# Altium schematic sheet relays_1-4_DS4E.SchDoc
size B
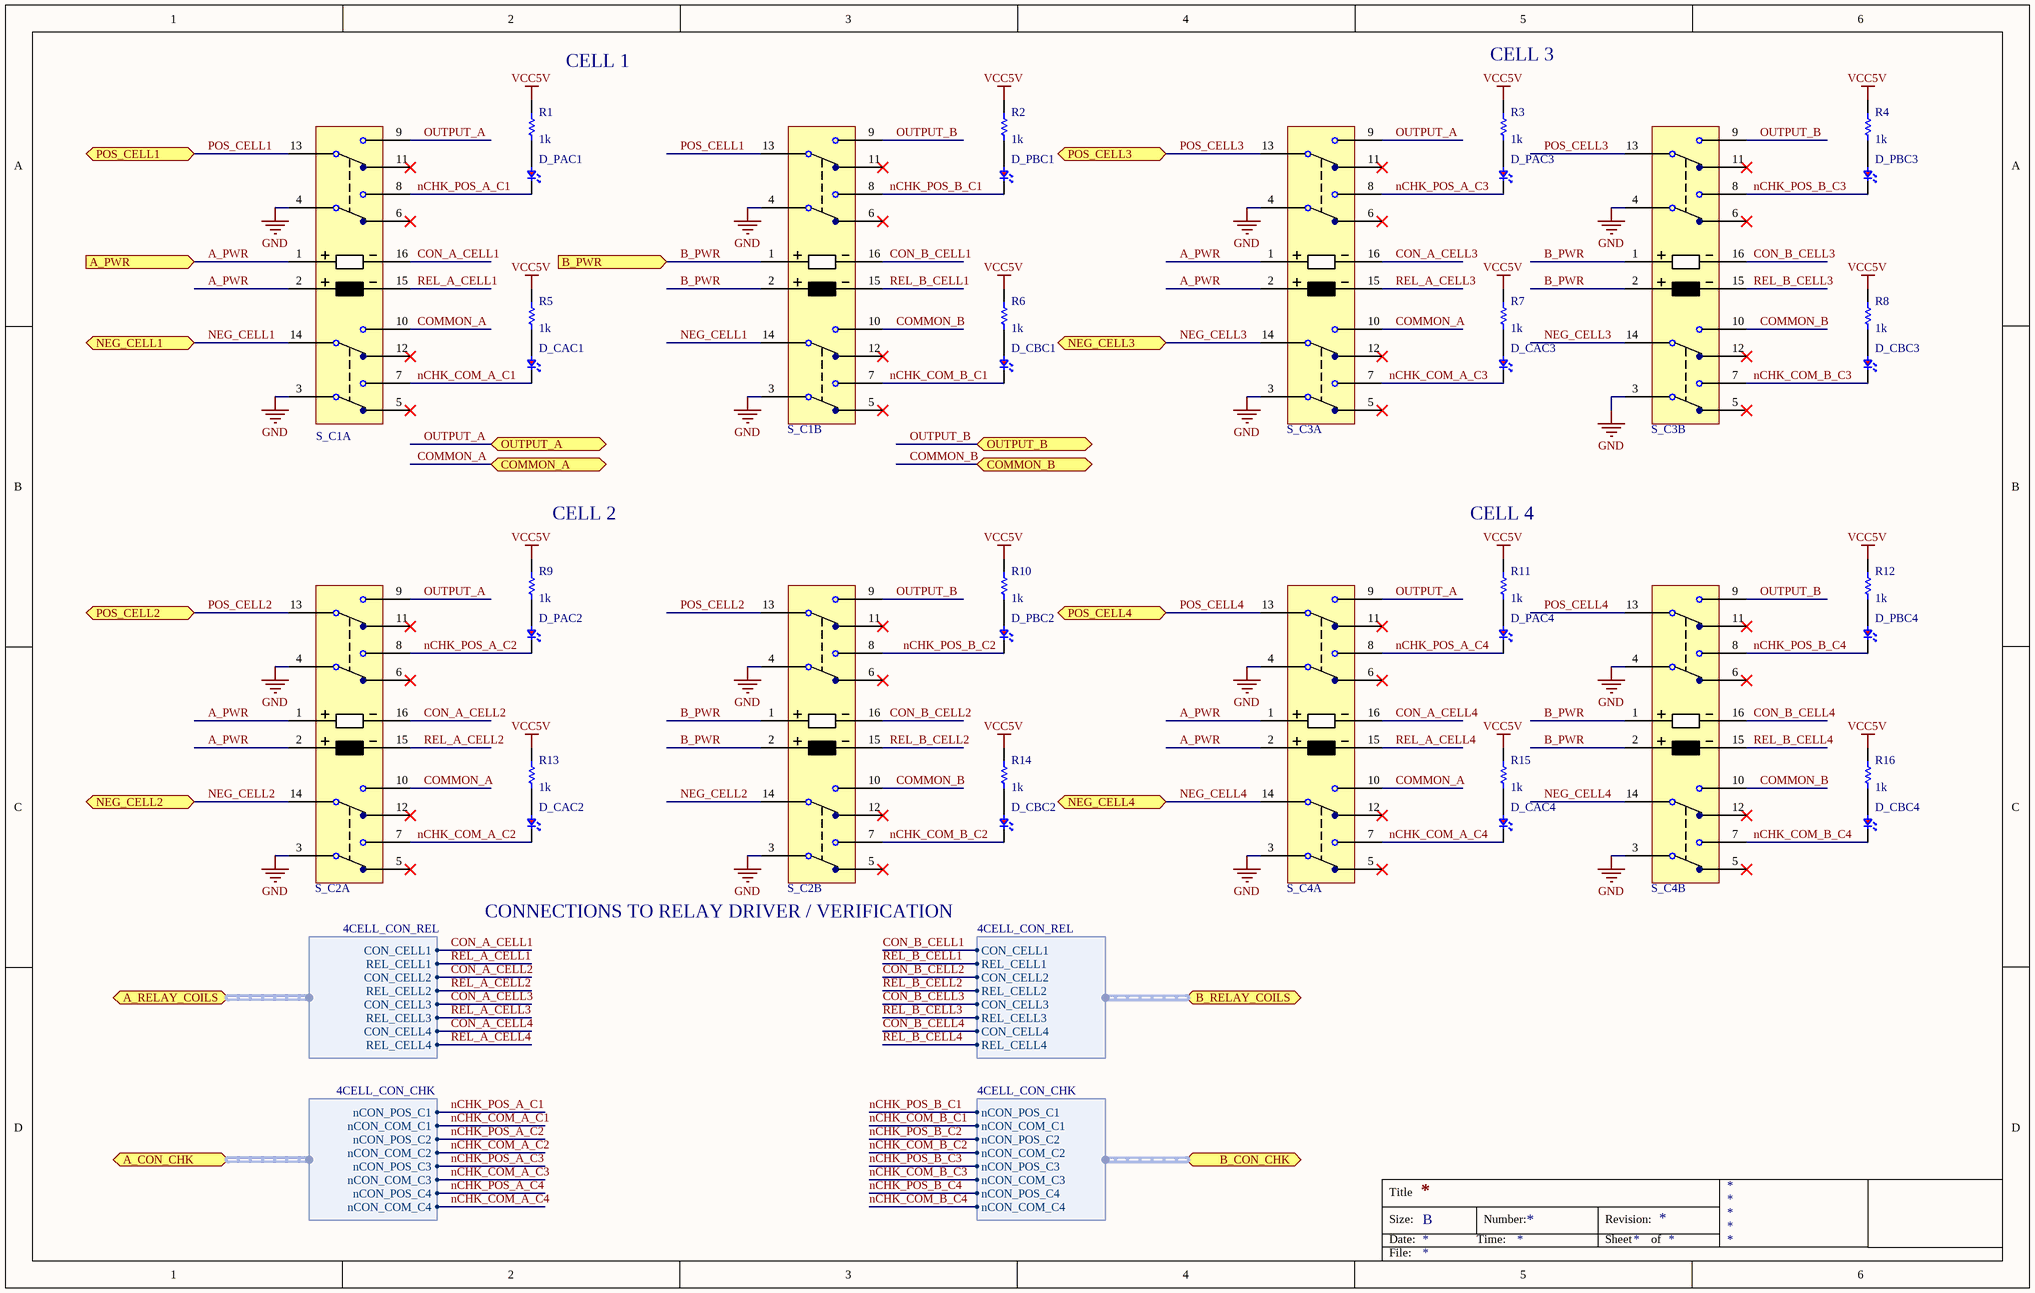
[diagram p0: relays_1-4_DS4E.SchDoc]

## Parts
D_CAC1  Red LED  [LEDRD100W25D118H196]  (value not drawn)
D_CAC2  Red LED  [LEDRD100W25D118H196]  (value not drawn)
D_CAC3  Red LED  [LEDRD100W25D118H196]  (value not drawn)
D_CAC4  Red LED  [LEDRD100W25D118H196]  (value not drawn)
D_CBC1  Red LED  [LEDRD100W25D118H196]  (value not drawn)
D_CBC2  Red LED  [LEDRD100W25D118H196]  (value not drawn)
D_CBC3  Red LED  [LEDRD100W25D118H196]  (value not drawn)
D_CBC4  Red LED  [LEDRD100W25D118H196]  (value not drawn)
D_PAC1  Red LED  [LEDRD100W25D118H196]  (value not drawn)
D_PAC2  Red LED  [LEDRD100W25D118H196]  (value not drawn)
D_PAC3  Red LED  [LEDRD100W25D118H196]  (value not drawn)
D_PAC4  Red LED  [LEDRD100W25D118H196]  (value not drawn)
D_PBC1  Red LED  [LEDRD100W25D118H196]  (value not drawn)
D_PBC2  Red LED  [LEDRD100W25D118H196]  (value not drawn)
D_PBC3  Red LED  [LEDRD100W25D118H196]  (value not drawn)
D_PBC4  Red LED  [LEDRD100W25D118H196]  (value not drawn)
R1  1k  [RESC2012X75L55N]
R2  1k  [RESC2012X75L55N]
R3  1k  [RESC2012X75L55N]
R4  1k  [RESC2012X75L55N]
R5  1k  [RESC2012X75L55N]
R6  1k  [RESC2012X75L55N]
R7  1k  [RESC2012X75L55N]
R8  1k  [RESC2012X75L55N]
R9  1k  [RESC2012X75L55N]
R10  1k  [RESC2012X75L55N]
R11  1k  [RESC2012X75L55N]
R12  1k  [RESC2012X75L55N]
R13  1k  [RESC2012X75L55N]
R14  1k  [RESC2012X75L55N]
R15  1k  [RESC2012X75L55N]
R16  1k  [RESC2012X75L55N]
S_C1A  4PDT_RELAY_L2  [L2_4PDT_RELAY]  (value not drawn)
S_C1B  4PDT_RELAY_L2  [L2_4PDT_RELAY]  (value not drawn)
S_C2A  4PDT_RELAY_L2  [L2_4PDT_RELAY]  (value not drawn)
S_C2B  4PDT_RELAY_L2  [L2_4PDT_RELAY]  (value not drawn)
S_C3A  4PDT_RELAY_L2  [L2_4PDT_RELAY]  (value not drawn)
S_C3B  4PDT_RELAY_L2  [L2_4PDT_RELAY]  (value not drawn)
S_C4A  4PDT_RELAY_L2  [L2_4PDT_RELAY]  (value not drawn)
S_C4B  4PDT_RELAY_L2  [L2_4PDT_RELAY]  (value not drawn)

## Ports
A_CON_CHK (harness 4CELL_CON_CHK), A_PWR (in), A_RELAY_COILS (harness 4CELL_CON_REL), B_CON_CHK (harness 4CELL_CON_CHK), B_PWR (in), B_RELAY_COILS (harness 4CELL_CON_REL), COMMON_A, COMMON_B, NEG_CELL1, NEG_CELL2, NEG_CELL3, NEG_CELL4, OUTPUT_A, OUTPUT_B, POS_CELL1, POS_CELL2, POS_CELL3, POS_CELL4

## Harnesses
4CELL_CON_REL: CON_CELL1, REL_CELL1, CON_CELL2, REL_CELL2, CON_CELL3, REL_CELL3, CON_CELL4, REL_CELL4
4CELL_CON_CHK: nCON_COM_C1, nCON_POS_C1, nCON_POS_C2, nCON_COM_C2, nCON_POS_C3, nCON_COM_C3, nCON_POS_C4, nCON_COM_C4

## Nets
GND: S_C1A.3 S_C1A.4 S_C1B.3 S_C1B.4 S_C2A.3 S_C2A.4 S_C2B.3 S_C2B.4 S_C3A.3 S_C3A.4 S_C3B.3 S_C3B.4 S_C4A.3 S_C4A.4 S_C4B.3 S_C4B.4
VCC5V: R1.2 R2.2 R3.2 R4.2 R5.2 R6.2 R7.2 R8.2 R9.2 R10.2 R11.2 R12.2 R13.2 R14.2 R15.2 R16.2
A_PWR: S_C1A.1 S_C1A.2 S_C2A.1 S_C2A.2 S_C3A.1 S_C3A.2 S_C4A.1 S_C4A.2 ; port A_PWR
B_PWR: S_C1B.1 S_C1B.2 S_C2B.1 S_C2B.2 S_C3B.1 S_C3B.2 S_C4B.1 S_C4B.2 ; port B_PWR
COMMON_A: S_C1A.10 S_C2A.10 S_C3A.10 S_C4A.10 ; port COMMON_A
COMMON_B: S_C1B.10 S_C2B.10 S_C3B.10 S_C4B.10 ; port COMMON_B
CON_A_CELL1: S_C1A.16 ; port A_RELAY_COILS.CON_CELL1
CON_A_CELL2: S_C2A.16 ; port A_RELAY_COILS.CON_CELL2
CON_A_CELL3: S_C3A.16 ; port A_RELAY_COILS.CON_CELL3
CON_A_CELL4: S_C4A.16 ; port A_RELAY_COILS.CON_CELL4
CON_B_CELL1: S_C1B.16 ; port B_RELAY_COILS.CON_CELL1
CON_B_CELL2: S_C2B.16 ; port B_RELAY_COILS.CON_CELL2
CON_B_CELL3: S_C3B.16 ; port B_RELAY_COILS.CON_CELL3
CON_B_CELL4: S_C4B.16 ; port B_RELAY_COILS.CON_CELL4
nCHK_COM_A_C1: D_CAC1.C S_C1A.7 ; port A_CON_CHK.nCON_COM_C1
nCHK_COM_A_C2: D_CAC2.C S_C2A.7 ; port A_CON_CHK.nCON_COM_C2
nCHK_COM_A_C3: D_CAC3.C S_C3A.7 ; port A_CON_CHK.nCON_COM_C3
nCHK_COM_A_C4: D_CAC4.C S_C4A.7 ; port A_CON_CHK.nCON_COM_C4
nCHK_COM_B_C1: D_CBC1.C S_C1B.7 ; port B_CON_CHK.nCON_COM_C1
nCHK_COM_B_C2: D_CBC2.C S_C2B.7 ; port B_CON_CHK.nCON_COM_C2
nCHK_COM_B_C3: D_CBC3.C S_C3B.7 ; port B_CON_CHK.nCON_COM_C3
nCHK_COM_B_C4: D_CBC4.C S_C4B.7 ; port B_CON_CHK.nCON_COM_C4
nCHK_POS_A_C1: D_PAC1.C S_C1A.8 ; port A_CON_CHK.nCON_POS_C1
nCHK_POS_A_C2: D_PAC2.C S_C2A.8 ; port A_CON_CHK.nCON_POS_C2
nCHK_POS_A_C3: D_PAC3.C S_C3A.8 ; port A_CON_CHK.nCON_POS_C3
nCHK_POS_A_C4: D_PAC4.C S_C4A.8 ; port A_CON_CHK.nCON_POS_C4
nCHK_POS_B_C1: D_PBC1.C S_C1B.8 ; port B_CON_CHK.nCON_POS_C1
nCHK_POS_B_C2: D_PBC2.C S_C2B.8 ; port B_CON_CHK.nCON_POS_C2
nCHK_POS_B_C3: D_PBC3.C S_C3B.8 ; port B_CON_CHK.nCON_POS_C3
nCHK_POS_B_C4: D_PBC4.C S_C4B.8 ; port B_CON_CHK.nCON_POS_C4
NEG_CELL1: S_C1A.14 S_C1B.14 ; port NEG_CELL1
NEG_CELL2: S_C2A.14 S_C2B.14 ; port NEG_CELL2
NEG_CELL3: S_C3A.14 S_C3B.14 ; port NEG_CELL3
NEG_CELL4: S_C4A.14 S_C4B.14 ; port NEG_CELL4
OUTPUT_A: S_C1A.9 S_C2A.9 S_C3A.9 S_C4A.9 ; port OUTPUT_A
OUTPUT_B: S_C1B.9 S_C2B.9 S_C3B.9 S_C4B.9 ; port OUTPUT_B
POS_CELL1: S_C1A.13 S_C1B.13 ; port POS_CELL1
POS_CELL2: S_C2A.13 S_C2B.13 ; port POS_CELL2
POS_CELL3: S_C3A.13 S_C3B.13 ; port POS_CELL3
POS_CELL4: S_C4A.13 S_C4B.13 ; port POS_CELL4
REL_A_CELL1: S_C1A.15 ; port A_RELAY_COILS.REL_CELL1
REL_A_CELL2: S_C2A.15 ; port A_RELAY_COILS.REL_CELL2
REL_A_CELL3: S_C3A.15 ; port A_RELAY_COILS.REL_CELL3
REL_A_CELL4: S_C4A.15 ; port A_RELAY_COILS.REL_CELL4
REL_B_CELL1: S_C1B.15 ; port B_RELAY_COILS.REL_CELL1
REL_B_CELL2: S_C2B.15 ; port B_RELAY_COILS.REL_CELL2
REL_B_CELL3: S_C3B.15 ; port B_RELAY_COILS.REL_CELL3
REL_B_CELL4: S_C4B.15 ; port B_RELAY_COILS.REL_CELL4
NetD_CAC1_A: D_CAC1.A R5.1
NetD_CAC2_A: D_CAC2.A R13.1
NetD_CAC3_A: D_CAC3.A R7.1
NetD_CAC4_A: D_CAC4.A R15.1
NetD_CBC1_A: D_CBC1.A R6.1
NetD_CBC2_A: D_CBC2.A R14.1
NetD_CBC3_A: D_CBC3.A R8.1
NetD_CBC4_A: D_CBC4.A R16.1
NetD_PAC1_A: D_PAC1.A R1.1
NetD_PAC2_A: D_PAC2.A R9.1
NetD_PAC3_A: D_PAC3.A R3.1
NetD_PAC4_A: D_PAC4.A R11.1
NetD_PBC1_A: D_PBC1.A R2.1
NetD_PBC2_A: D_PBC2.A R10.1
NetD_PBC3_A: D_PBC3.A R4.1
NetD_PBC4_A: D_PBC4.A R12.1

Not connected (* = marked no-connect by the designer): S_C1A 5* 6* 11* 12*; S_C1B 5* 6* 11* 12*; S_C2A 5* 6* 11* 12*; S_C2B 5* 6* 11* 12*; S_C3A 5* 6* 11* 12*; S_C3B 5* 6* 11* 12*; S_C4A 5* 6* 11* 12*; S_C4B 5* 6* 11* 12*

## Notes on the sheet
- (near R1) CELL 1
- (near R3) CELL 3
- (near R9) CELL 2
- (near R11) CELL 4
- (near S_C2B) CONNECTIONS TO RELAY DRIVER / VERIFICATION
- Title
- Size:
- Date:
- B
- Time:
- Number:
- Revision:
- Sheet
- of
- File:

## Library data of the parts
D_CAC1-D_CAC4 D_CBC1-D_CBC4 D_PAC1-D_PAC4 D_PBC1-D_PBC4 = SSI-LXH600ID-150: LED 5MM RED DIFF 6"LDS PANEL MT; Manufacturer: Lumex Opto/Components Inc.; Design Item Id: SSI-LXH600ID-150; Supplier 1: Digi-Key; Supplier Part Number 1: 67-1188-ND; Manufacturer Part Number: SSI-LXH600ID-150; RoHS: RoHS Compliant; Category: Optoelectronics; Stock 1: 4731; Pricing 1: 1=1.3, 10=1.06, 25=0.8152, 100=0.7335, 250=0.652, 500=0.5542, 1000=0.4564, 2500=0.43358, 5000=0.4238 (USD)
R1-R16 = ERJ-P06J102V: RES SMD 1K OHM 5% 1/2W 0805; Manufacturer: Panasonic Electronic Components; Resistance: 1k; Design Item Id: ERJ-P06J102V; Supplier 1: Digi-Key; Supplier Part Number 1: P1.0KADCT-ND; Manufacturer Part Number: ERJ-P06J102V; RoHS: RoHS Compliant; Category: Resistors; Stock 1: 1542; Pricing 1: 1=0.12, 10=0.112, 100=0.0429, 1000=0.01889, 2500=0.01632 (USD); Packaging: Cut Tape (CT)
S_C1A S_C1B S_C2A S_C2B S_C3A S_C3B S_C4A S_C4B = DS4E-ML2-DC5V: RELAY GENERAL PURPOSE 4PDT 2A 5V; Manufacturer: Panasonic Electric Works; Coil Type: Latching, Dual Coil; Coil Voltage: 5VDC; Contact Form: 4PDT (4 Form C); Switching Voltage: 250VAC, 220VDC - Max; Turn On Voltage (Max): 3.5 VDC; Coil Power: 360 mW; Design Item Id: DS4E-ML2-DC5V; Supplier 1: Digi-Key; Supplier Part Number 1: 255-1615-ND; Manufacturer Part Number: DS4E-ML2-DC5V; RoHS: RoHS Compliant; Category: Relays; Stock 1: 0; Pricing 1: 50=0 (USD); Packaging: Bulk; Features: Sealed - Amber; Operating Temperature: -40°C ~ 70°C; Mounting Type: Through Hole; ComponentLink1URL: http://media.digikey.com/pdf/Data%20Sheets/Panasonic%20Electric%20Works%20PDFs/DS_Series_July_2009.pdf; ComponentLink1Description: http://media.digikey.com/pdf/Data%20Sheets/Panasonic%20Electric%20Works%20PDFs/DS_Series_July_2009.pdf; Termination Style: PC Pin; Part Status: Obsolete; Relay Type: General Purpose; Turn Off Voltage (Min): -; Contact Material: Silver (Ag), Gold (Au)